# Altium schematic sheet RibbonCable.SchDoc: M1 Test Fixture Custom Board
size OrCAD B; Author: Leo Buchman; Revision: B; SheetNumber: 2; SheetTotal: 4
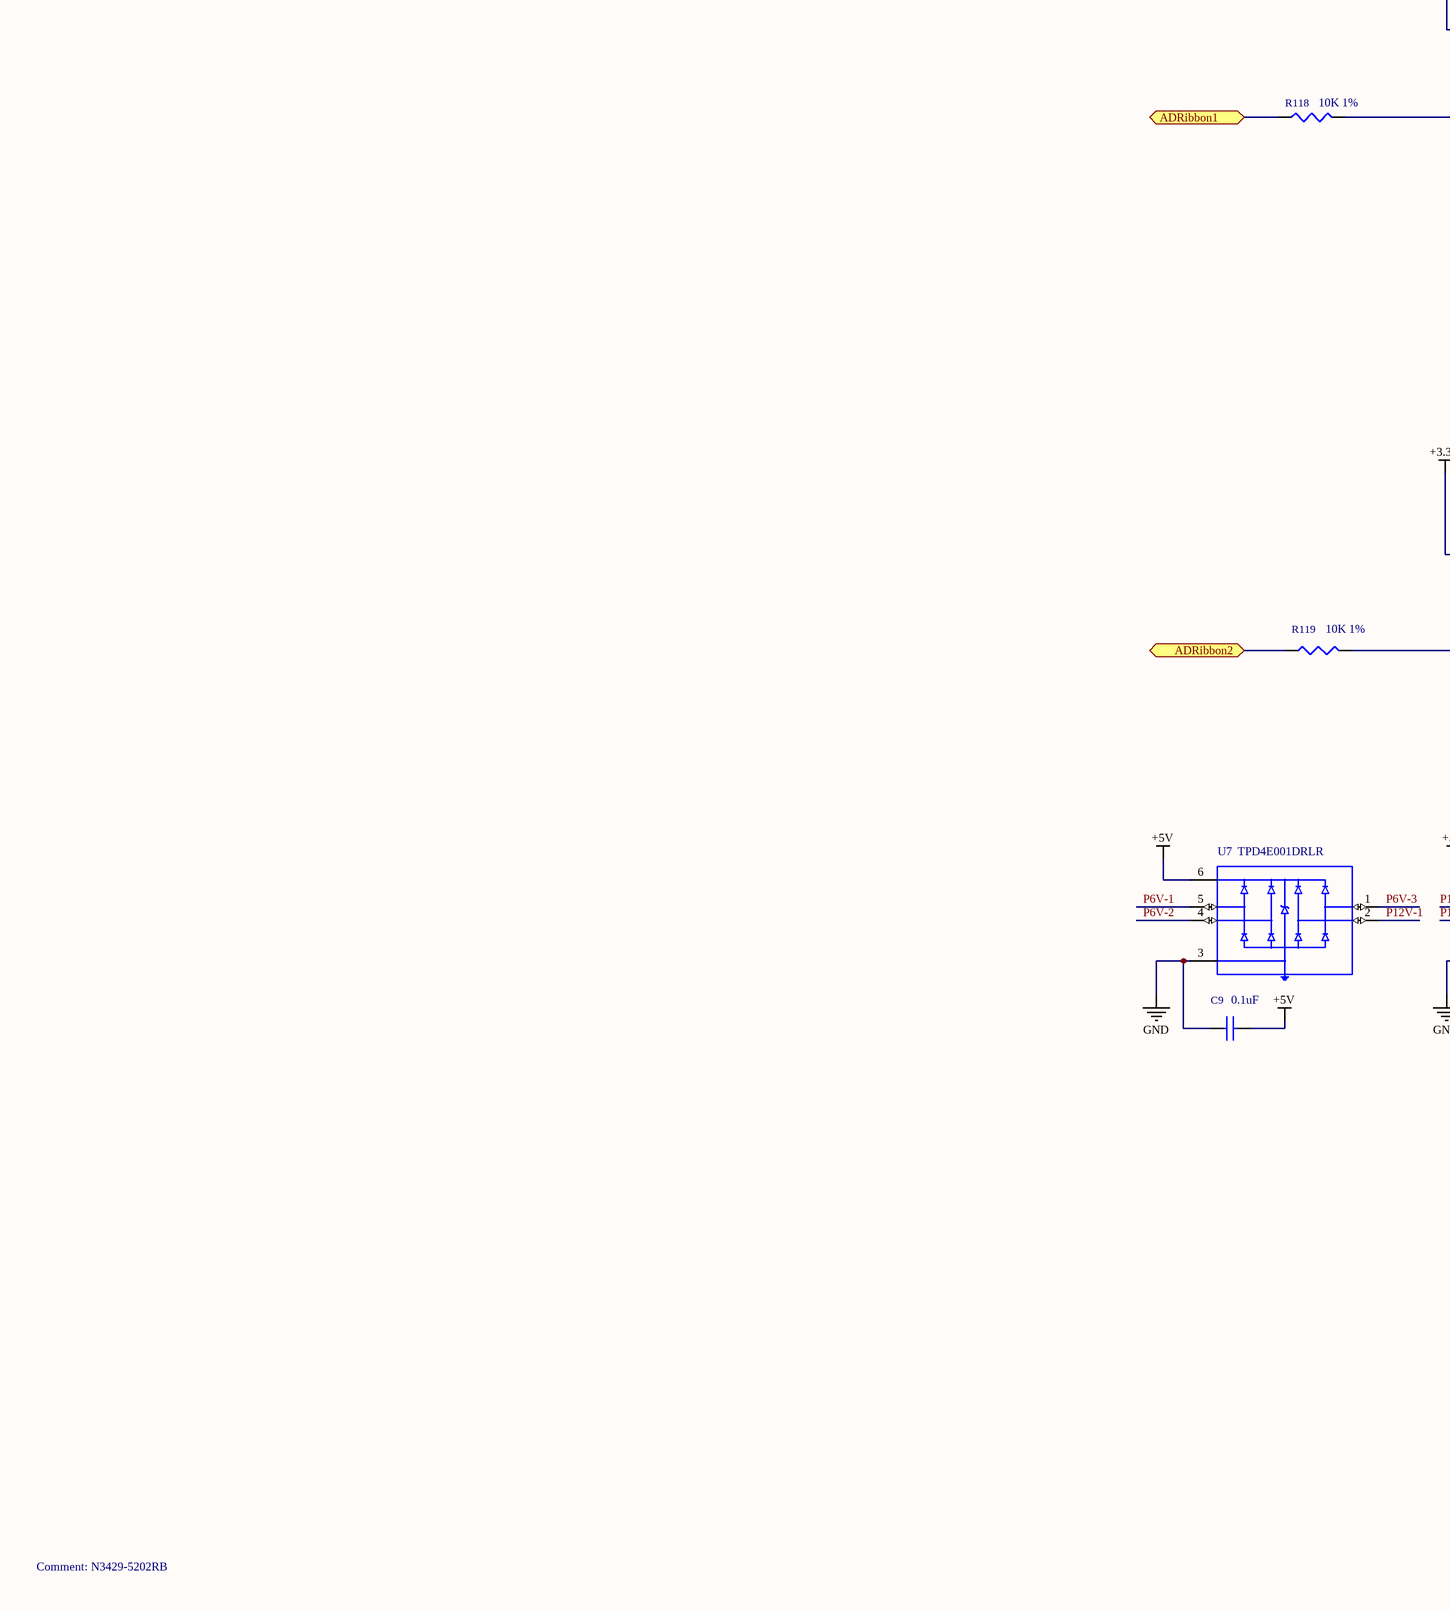
[diagram p0: RibbonCable.SchDoc, left]
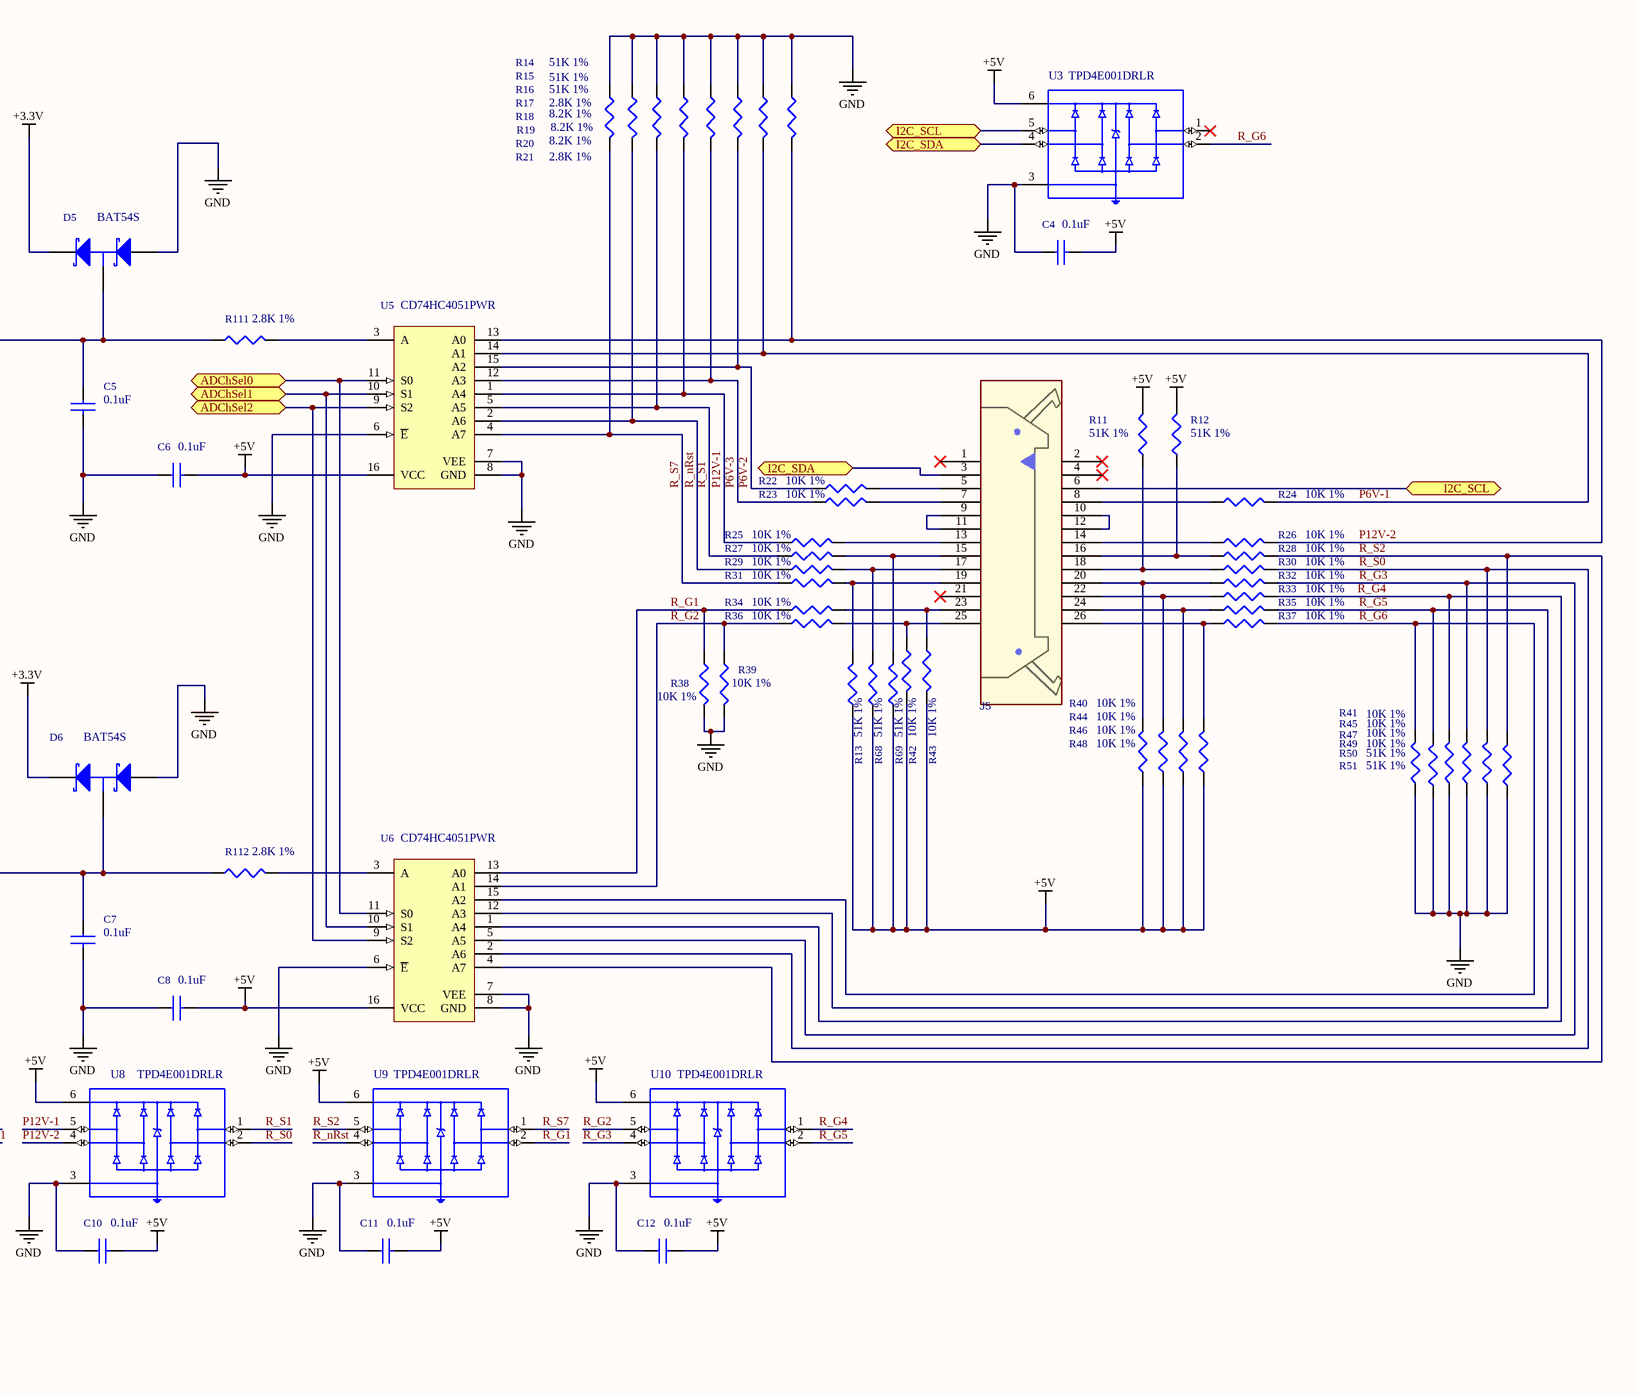
[diagram p1: RibbonCable.SchDoc, right]

## Parts
C4  0.1uF  [C0402]
C5  0.1uF  [C0402]
C6  0.1uF  [C0402]
C7  0.1uF  [C0402]
C8  0.1uF  [C0402]
C9  0.1uF  [C0402]
C10  0.1uF  [C0402]
C11  0.1uF  [C0402]
C12  0.1uF  [C0402]
D5  BAT54S  [sot23-3]
D6  BAT54S  [sot23-3]
J5  N3429-5202RB  [CONN_N3429-5202RB]
R11  51K 1%  [R0402]
R12  51K 1%  [R0402]
R13  51K 1%  [R0402]
R14  51K 1%  [R0402]
R15  51K 1%  [R0402]
R16  51K 1%  [R0402]
R17  2.8K 1%  [R0402]
R18  8.2K 1%  [R0402]
R19  8.2K 1%  [R0402]
R20  8.2K 1%  [R0402]
R21  2.8K 1%  [R0402]
R22  10K 1%  [R0402]
R23  10K 1%  [R0402]
R24  10K 1%  [R0402]
R25  10K 1%  [R0402]
R26  10K 1%  [R0402]
R27  10K 1%  [R0402]
R28  10K 1%  [R0402]
R29  10K 1%  [R0402]
R30  10K 1%  [R0402]
R31  10K 1%  [R0402]
R32  10K 1%  [R0402]
R33  10K 1%  [R0402]
R34  10K 1%  [R0402]
R35  10K 1%  [R0402]
R36  10K 1%  [R0402]
R37  10K 1%  [R0402]
R38  10K 1%  [R0402]
R39  10K 1%  [R0402]
R40  10K 1%  [R0402]
R41  10K 1%  [R0402]
R42  10K 1%  [R0402]
R43  10K 1%  [R0402]
R44  10K 1%  [R0402]
R45  10K 1%  [R0402]
R46  10K 1%  [R0402]
R47  10K 1%  [R0402]
R48  10K 1%  [R0402]
R49  10K 1%  [R0402]
R50  51K 1%  [R0402]
R51  51K 1%  [R0402]
R68  51K 1%  [R0402]
R69  51K 1%  [R0402]
R111  2.8K 1%  [R0402]
R112  2.8K 1%  [R0402]
R118  10K 1%  [R0402]
R119  10K 1%  [R0402]
U3  TPD4E001DRLR  [SOTFL50P160X60-6N]
U5  CD74HC4051PWR  [16-TSSOP-4.4mm]
U6  CD74HC4051PWR  [16-TSSOP-4.4mm]
U7  TPD4E001DRLR  [SOTFL50P160X60-6N]
U8  TPD4E001DRLR  [SOTFL50P160X60-6N]
U9  TPD4E001DRLR  [SOTFL50P160X60-6N]
U10  TPD4E001DRLR  [SOTFL50P160X60-6N]

## Ports
ADChSel0 (bidir), ADChSel1 (bidir), ADChSel2 (bidir), ADRibbon1 (bidir), ADRibbon2 (bidir), I2C_SCL (bidir), I2C_SDA (bidir)

## Nets
+3.3V: D5.2(K) D6.2(K)
+5V: C4.2 C6.2 C8.2 C9.2 C10.2 C11.2 C12.2 R11.2 R12.2 R13.1 R40.1 R42.2 R43.2 R44.1 R46.1 R48.1 R68.1 R69.1 U3.6(VCC) U5.16(VCC) U6.16(VCC) U7.6(VCC) U8.6(VCC) U9.6(VCC) U10.6(VCC)
GND: C4.1 C5.2 C6.1 C7.2 C8.1 C9.1 C10.1 C11.1 C12.1 D5.1(A) D6.1(A) R14.1 R15.1 R16.1 R17.1 R18.1 R19.1 R20.1 R21.1 R38.2 R39.2 R41.1 R45.1 R47.1 R49.1 R50.1 R51.1 U3.3(GND) U5.6(~{E}) U5.7(VEE) U5.8(GND) U6.6(~{E}) U6.7(VEE) U6.8(GND) U7.3(GND) U8.3(GND) U9.3(GND) U10.3(GND)
ADChSel0: U5.11(S0) U6.11(S0) ; port ADChSel0
ADChSel1: U5.10(S1) U6.10(S1) ; port ADChSel1
ADChSel2: U5.9(S2) U6.9(S2) ; port ADChSel2
ADRibbon1: R118.1 ; port ADRibbon1
ADRibbon2: R119.1 ; port ADRibbon2
I2C_SCL: J5.6 U3.5(IO4) ; port I2C_SCL
I2C_SDA: J5.3 U3.4(IO3) ; port I2C_SDA
P6V-1: R20.2 R24.2 U5.14(A1) U7.5(IO4)
P6V-2: R19.2 R22.1 U5.15(A2) U7.4(IO3)
P6V-3: R18.2 R23.1 U5.12(A3) U7.1(IO1)
P12V-1: R17.2 R25.1 U5.1(A4) U7.2(IO2) U8.5(IO4)
P12V-2: R21.2 R26.2 U5.13(A0) U8.4(IO3)
R_G1: R34.1 R38.1 U6.13(A0) U9.2(IO2)
R_G2: R36.1 R39.1 U6.14(A1) U10.5(IO4)
R_G3: R32.2 R49.2 U6.5(A5) U10.4(IO3)
R_G4: R33.2 R47.2 U6.1(A4) U10.1(IO1)
R_G5: R35.2 R45.2 U6.12(A3) U10.2(IO2)
R_G6: R37.2 R41.2 U3.2(IO2) U6.15(A2)
R_nRst: R15.2 R29.1 U5.2(A6) U9.4(IO3)
R_S0: R30.2 R50.2 U6.2(A6) U8.2(IO2)
R_S1: R16.2 R27.1 U5.5(A5) U8.1(IO1)
R_S2: R28.2 R51.2 U6.4(A7) U9.5(IO4)
R_S7: R14.2 R31.1 U5.4(A7) U9.1(IO1)
NetC5_1: C5.1 D5.3(C) R111.1 R118.2
NetC7_1: C7.1 D6.3(C) R112.1 R119.2
NetJ5_5: J5.5 R22.2
NetJ5_7: J5.7 R23.2
NetJ5_8: J5.8 R24.1
NetJ5_9: J5.9 J5.11
NetJ5_10: J5.10 J5.12
NetJ5_13: J5.13 R25.2
NetJ5_14: J5.14 R26.1
NetJ5_15: J5.15 R27.2 R69.2
NetJ5_16: J5.16 R12.1 R28.1
NetJ5_17: J5.17 R29.2 R68.2
NetJ5_18: J5.18 R11.1 R30.1
NetJ5_19: J5.19 R13.2 R31.2
NetJ5_20: J5.20 R32.1 R40.2
NetJ5_22: J5.22 R33.1 R44.2
NetJ5_23: J5.23 R34.2 R43.1
NetJ5_24: J5.24 R35.1 R46.2
NetJ5_25: J5.25 R36.2 R42.1
NetJ5_26: J5.26 R37.1 R48.2
NetR111_2: R111.2 U5.3(A)
NetR112_2: R112.2 U6.3(A)

Not connected (* = marked no-connect by the designer): J5 1* 2* 4* 21*; U3 1(IO1)*

## Library data of the parts
C4-C12 = Cap-00005: Cap Ceramic 0.1uF 50V X7R 10% Pad SMD 0402 125C Automotive T/R; Manufacturer: Murata; Manufacturer Part Number: GRT155R71H104KE01D; Part Name: Cap-00005; Supplier 1: Digi-Key; Supplier Part Number 1: 490-GRT155R71H104KE01DCT-ND; RoHS: Yes; Category: Ceramic Capacitors; Stock 1: 179948; Pricing 1: 1=0.10000, 10=0.04700, 50=0.02580, 100=0.0211; Mount: Surface Mount; Case/Package: 0402; Case Code (Metric): 1005; Case Code (Imperial): 0402; RoHS Compliant: Yes; LCSC Part Number: C307331; Number of Pins: 2; Dielectric Material: Ceramic; Termination: SMD/SMT; Voltage Rating (DC): 50V
D5 D6 = Diode-0009: DIODE SCHOTTKY 30V 150MA SOT23-3; Manufacturer: Sangdest Microelectronics; Manufacturer: ON Semiconductor / Fairchild; Recovery Time: 5ns; Package Version: Rev. 12, 03/2016; Peak Reverse Current: 2uA; Elements: 2; Package Reference: SOT23-3; Package URL: http://www.fairchildsemi.com/dwg/MA/MA03D.pdf; Pins: 3; Datasheet URL: https://www.fairchildsemi.com/datasheets/BA/BAT54S.pdf; Manufacturer URL: https://www.fairchildsemi.com/; Datasheet Version: Rev. 2.3, 04/2016; Mounting Technology: SM; Package Description: 3-Pin Small Outline Transistor, Body 2.92 x 1.325 mm, Pitch 0.95 mm; Manufacturer Part Number: BAT54S; Component Type: Diodes; Part Name: Diode-0009; Supplier 1: Digi-Key; Supplier Part Number 1: 1655-BAT54SCT-ND; RoHS: Yes; Stock 1: 168252; Pricing 1: 1=0.43000, 10=0.35100, 100=0.18620, 500=0.122; Mount: Surface Mount; Radiation Hardening: No; Lead Free: Lead Free; LCSC Part Number: C47546
J5 = CON-0010: 3000 Series; 2.54mm Pitch 26 Way 2 Row Right; Manufacturer: 3M; ATTR: CONN HEADER LATCH/EJEC  RTA DUAL ROW 26POS; PKG: 2M54_13x2_TH_LATCH; Connector Type: Male Pin; Number of Positions: 26; Current Rating: 1A; Voltage Rating: 300V; Gender: Male; Number of Positions Per Level: 8; Number of Levels: 1; Max Current Rating: 2A; Current: 12A; Shrouded: Yes (With); Tail Length: 3.5mm; Wire Gauge (Max): 30AWG; Row Spacing: 0.1inch; Closed End: No (Without); Plating: Brass; Thread Size: M2; Part Name: CON-0010; Supplier 1: Digi-Key; Supplier Part Number 1: MHR26S-ND; Manufacturer Part Number: N3429-5202RB; RoHS: Yes; Stock 1: 185; Pricing 1: 1=5.34000, 10=4.85100, 100=4.27430, 500=3.633; LCSC Part Number: N/A; Category: Headers and Wire Housings; Mount: Through Hole; Color: Black; Contact Material: Copper Alloy,Copper; Contact Plating: Gold; Housing Material: Polychlorinated; Min Operating Temperature: -55°C; Max Operating Temperature: 105°C; Packaging: Bulk; Number of Rows: 2; Termination: Solder; ComponentLink1URL: https://datasheet.ciiva.com/19461/1578947-194; ComponentLink1Description: https://datasheet.ciiva.com/19461/1578947-194; Package Quantity: 250; Series: 3000; Contact Type: Male Pin; Pitch: 2.54mm; Contact Mating Length: 0.24inch; RoHS Compliant: Yes; Number of Contacts: 26; REACH SVHC: No SVHC; Lead Free: Lead Free; ComponentLink2URL: https://datasheet.ciiva.com/11754/0900766b807; ComponentLink2Description: https://datasheet.ciiva.com/11754/0900766b807; ComponentLink3URL: https://datasheet.ciiva.com/719/ts0772-719341; ComponentLink3Description: https://datasheet.ciiva.com/719/ts0772-719341; ComponentLink4URL: https://datasheet.ciiva.com/8051/ts0772-80510; ComponentLink4Description: https://datasheet.ciiva.com/8051/ts0772-80510; Flammability Rating: UL94 V-0; Orientation: Right Angle; Length: 52.45mm; Depth: 24.6mm; Voltage: 300V; ComponentLink5URL: https://datasheet.ciiva.com/30156/eng-cs-1308; ComponentLink5Description: https://datasheet.ciiva.com/30156/eng-cs-1308; ComponentLink6URL: https://datasheet.ciiva.com/3141/eng-cs-13083; ComponentLink6Description: https://datasheet.ciiva.com/3141/eng-cs-13083; Housing Color: Black; Fastening Type: Latch; Max Voltage Rating (AC): 300V; Height: 8.6mm; Radiation Hardening: No; ELV: Compliant; ComponentLink7URL: https://datasheet.ciiva.com/823/eng-cd-284391; ComponentLink7Description: https://datasheet.ciiva.com/823/eng-cd-284391; Number of Circuits: 8; Wire Gauge (Min): 30AWG; Interlock: Yes (With); Max Supply Voltage (AC): 300V; Screw Flange: No (Without); Screwless Terminal Block: No (Without); Side Stackable: Yes (With)
R11-R16 R50 R51 R68 R69 = Res-00011: Res Thick Film 0402 51K Ohm 1% 0.063W(1/16W) ±100ppm/C Pad SMD Automotive T/R; Manufacturer: Stackpole Electronics; Manufacturer Part Number: RMCF0402FT51K0; Resistance: 51kR; Max Power Dissipation: 63mW; Temperature Coefficient: 100ppm/°C; Part Name: Res-00011; Supplier 1: Digi-Key; Supplier Part Number 1: RMCF0402FT51K0CT-ND; RoHS: Yes; Category: Chip SMD Resistors; Stock 1: 588931; Pricing 1: 1=0.10000, 10=0.01500, 100=0.00610, 1000=0.00; Case/Package: 0402; Case Code (Metric): 1005; Case Code (Imperial): 0402; Min Operating Temperature: -55°C; Max Operating Temperature: 155°C; Packaging: Tape and Reel; Resistor Type: Thick Film; Number of Terminations: 2; Tolerance: 1%; Features: Automotive AEC-Q200; Length: 0.039inch; Width: 0.02inch; Height: 0.016inch; RoHS Compliant: Yes; ComponentLink1URL: http://components.arrow.com/part/dataview/535; ComponentLink1Description: http://components.arrow.com/part/dataview/535; ComponentLink2URL: https://www.seielect.com/catalog/SEI-RMCF_RMC; ComponentLink2Description: https://www.seielect.com/catalog/SEI-RMCF_RMC; ComponentLink3URL: https://www.seielect.com/Catalog/SEI-RMCF_RMC; ComponentLink3Description: https://www.seielect.com/Catalog/SEI-RMCF_RMC; ComponentLink4URL: https://www.seielect.com/catalog/SEI-Packagin; ComponentLink4Description: https://www.seielect.com/catalog/SEI-Packagin; LCSC Part Number: C25794; Mount: Surface Mount; Contact Plating: Tin,Matte; Power Rating: 63mW; Series: RMCF; Radiation Hardening: No
R17 R21 R111 R112 = Res-00008: Thick Film 0402 2.8K Ohm 1% 0.063W ±100ppm/°C Molded SMD Paper T/R; Manufacturer: Stackpole Electronics; Manufacturer Part Number: RMCF0402FT2K80; Resistance: 2.8kR; Max Power Dissipation: 63mW; Power Rating: 62.5mW; Part Name: Res-00008; Supplier 1: Digi-Key; Supplier Part Number 1: RMCF0402FT2K80CT-ND; RoHS: Yes; Category: Chip SMD Resistors; Stock 1: 141882; Pricing 1: 1=0.10000, 10=0.01500, 100=0.00610, 1000=0.00; Case/Package: 0402; Case Code (Metric): 1005; Case Code (Imperial): 0402; Min Operating Temperature: -55°C; Max Operating Temperature: 155°C; Packaging: Tape and Reel; Resistor Type: Thick Film; Number of Terminations: 2; Tolerance: 1%; Temperature Coefficient: 100ppm/°C; Features: Automotive AEC-Q200; Length: 0.039inch; Width: 0.02inch; Height: 0.016inch; RoHS Compliant: Yes; ComponentLink1URL: https://www.seielect.com/catalog/SEI-RMCF_RMC; ComponentLink1Description: https://www.seielect.com/catalog/SEI-RMCF_RMC; ComponentLink2URL: https://www.seielect.com/Catalog/SEI-RMCF_RMC; ComponentLink2Description: https://www.seielect.com/Catalog/SEI-RMCF_RMC; ComponentLink3URL: https://www.seielect.com/catalog/SEI-Packagin; ComponentLink3Description: https://www.seielect.com/catalog/SEI-Packagin; LCSC Part Number: C62741; Mount: Surface Mount; Contact Plating: Tin,Matte; Series: RMCF; Radiation Hardening: No; Lead Free: Lead Free
R18-R20 = Res-00012: Res Thick Film 0402 8.2K Ohm 5% 0.063W ±100ppm/°C Molded SMD Paper T/R; Manufacturer: Stackpole Electronics; Manufacturer Part Number: RMCF0402JT8K20; Resistance: 8.2kR; Max Power Dissipation: 63mW; Part Name: Res-00012; Supplier 1: Digi-Key; Supplier Part Number 1: 738-RMCF0402JT8K20CT-ND; RoHS: Yes; Category: Chip SMD Resistors; Stock 1: 9938; Pricing 1: 1=0.10000, 10=0.01200, 100=0.00470, 1000=0.00; Case/Package: 0402; Case Code (Metric): 1005; Case Code (Imperial): 0402; Min Operating Temperature: -55°C; Max Operating Temperature: 155°C; Packaging: Tape and Reel; Resistor Type: Thick Film; Number of Terminations: 2; Tolerance: 5%; Temperature Coefficient: 100ppm/°C; Features: Automotive AEC-Q200; Length: 0.039inch; Width: 0.02inch; Height: 0.016inch; RoHS Compliant: Yes; ComponentLink1URL: https://www.seielect.com/Catalog/SEI-RMCF_RMC; ComponentLink1Description: https://www.seielect.com/Catalog/SEI-RMCF_RMC; ComponentLink2URL: https://www.seielect.com/catalog/sei-rmcf_rmc; ComponentLink2Description: https://www.seielect.com/catalog/sei-rmcf_rmc; ComponentLink3URL: https://www.seielect.com/catalog/SEI-RMCF_RMC; ComponentLink3Description: https://www.seielect.com/catalog/SEI-RMCF_RMC; ComponentLink4URL: http://www.seielect.com/Catalog/Sei-RMC.pdf?s; ComponentLink4Description: http://www.seielect.com/Catalog/Sei-RMC.pdf?s; LCSC Part Number: C25924; Mount: Surface Mount; Contact Plating: Tin,Matte; Power Rating: 63mW; Series: RMCF; Radiation Hardening: No; Size Code: 0402; Lead Free: Lead Free
R22-R49 R118 R119 = Res-00002: Thick Film 0402 10K OHM 1% 1/16W 0402; Manufacturer: Yageo; Manufacturer Part Number: RC0402FR-0710KP; Max Power Dissipation: 63mW; Temperature Coefficient: 150ppm/°C; Power Rating: 62.5mW; Part Name: Res-00002; Supplier 1: Digi-Key; Supplier Part Number 1: YAG1249CT-ND; RoHS: Yes; Category: Chip SMD Resistors; Stock 1: 161500; Pricing 1: 1=0.10000, 10=0.03600, 100=0.01450, 1000=0.00; Case/Package: 0402; Case Code (Metric): 1005; Case Code (Imperial): 0402; Min Operating Temperature: -55°C; Max Operating Temperature: 155°C; Packaging: Tape and Reel; Resistance: 10k; Resistor Type: Thick Film; Number of Terminations: 2; Tolerance: 1%; Features: Moisture Resistant; Length: 0.039inch; Width: 0.02inch; Height: 0.016inch; RoHS Compliant: Yes; ComponentLink1URL: http://www.yageo.com/NewPortal/yageodocoutput; ComponentLink1Description: http://www.yageo.com/NewPortal/yageodocoutput; LCSC Part Number: C25744; Mount: Surface Mount
U3 U7-U10 = Diode-0012: TVS DIODE 5.5VWM SOT6; Manufacturer: Texas Instruments; Capacitance: 1.5pF; Max Power Dissipation: 100W; Breakdown Voltage: 11V; Direction: Unidirectional; Reverse Standoff Voltage: 5.5V; Clamping Voltage: 105.5V; Power Line Protection: Yes; Number of Channels: 4; Leakage Current: 1nA; Peak Pulse Current: 5.5A; Interface: LVDS,USB,Ethernet; Part Name: Diode-0012; Supplier 1: Digi-Key; Supplier Part Number 1: 296-21887-1-ND; Manufacturer Part Number: TPD4E001DRLR; RoHS: Yes; Category: ESD and Circuit Protection ICs; Stock 1: 42388; Pricing 1: 1=0.66000, 10=0.58100, 100=0.44520, 500=0.351; Mount: Surface Mount; Case/Package: SOT; Packaging: Tape and Reel; RoHS Compliant: Yes; ComponentLink1URL: https://datasheet.ciiva.com/5839/1535398-5839; ComponentLink1Description: https://datasheet.ciiva.com/5839/1535398-5839; ComponentLink2URL: https://datasheet.ciiva.com/22696/1831342-226; ComponentLink2Description: https://datasheet.ciiva.com/22696/1831342-226; ComponentLink3URL: https://datasheet.ciiva.com/1219/tpd4e001-121; ComponentLink3Description: https://datasheet.ciiva.com/1219/tpd4e001-121; Number of Pins: 6; Min Operating Temperature: -40°C; Max Operating Temperature: 85°C; Package Quantity: 1; Series: -; Radiation Hardening: No; Lead Free: Lead Free; ComponentLink4URL: https://datasheet.ciiva.com/15134/getdatashee; ComponentLink4Description: https://datasheet.ciiva.com/15134/getdatashee; ComponentLink5URL: https://datasheet.ciiva.com/7659/1853592-7659; ComponentLink5Description: https://datasheet.ciiva.com/7659/1853592-7659; ComponentLink6URL: https://datasheet.ciiva.com/338/tpd4e001-3380; ComponentLink6Description: https://datasheet.ciiva.com/338/tpd4e001-3380; ComponentLink7URL: https://datasheet.ciiva.com/338/tpd4e001-3380; ComponentLink7Description: https://datasheet.ciiva.com/338/tpd4e001-3380; ComponentLink8URL: https://datasheet.ciiva.com/338/tpd4e001-3380; ComponentLink8Description: https://datasheet.ciiva.com/338/tpd4e001-3380; LCSC Part Number: C527516; Length: 1.6mm; Depth: 1.2mm; Width: 1.2mm; Height: 0.55mm; Contact Plating: Gold; Weight: 9.9E-05oz; Termination: SMD/SMT; REACH SVHC: No SVHC; Min Breakdown Voltage: 11V; Peak Pulse Power: 100W; Polarity: Unidirectional; Working Voltage: 5.5V; Max Breakdown Voltage: 11V; Operating Supply Voltage: 5.5V; Number of Bidirectional Channels: 4; ComponentLink9URL: https://datasheet.ciiva.com/14423/tpd4e001-14; ComponentLink9Description: https://datasheet.ciiva.com/14423/tpd4e001-14
U5 U6 = AIC-0001: 5-V, 8: 1, 1-channel analog mutliplexer 16-TS; Manufacturer: Texas Instruments; VCC(Max)(V): 6; Ron(Typ)(Ohms): 45; Rating: Catalog; VCC(Min)(V): 2; Ron(Max)(Ohms): 130; Configuration: 1 X 1：8 MUX; Crosstalk: Yes; Bandwidth(Max)(MHz): 180; Bandwidth: 180MHz; Propagation Delay: 60ns; Number of Outputs: 1; Max Supply Voltage: 6V; Min Supply Voltage: 2V; Number of Inputs: 8; Min Dual Supply Voltage: 1V; Max Dual Supply Voltage: 5V; Dual Supply Voltage: 3V; Logic Function: Multiplexer,Demultiplexer; On-State Resistance: 130R; Turn-On Delay Time: 225ns; Supply Type: Single,Dual; Nominal Supply Current: 16uA; Polarity: Non-Inverting; Low Level Output Current: 25mA; PackageVersion: http://www.ti.com/lit/ml/mpds178g/mpds178g.pdf; Generic Part Number: CD74HC4051; PackageReference: D0016A; Operating Temperature Range(C): -55 to 125; DatasheetVersion: SCHS122J; Code_JEDEC: MS-012 variation AC; Manufacturer Part Number: CD74HC4051PWR; Part Name: AIC-0001; LCSC Part Number: C352826; Supplier 1: Newark; Supplier Part Number 1: 29AH3620; RoHS: Yes; Category: Decoders and Multiplexers; Stock 1: 12645; Pricing 1: 1=0.33420, 10=0.26780, 30=0.23940, 100=0.2039; Mount: Surface Mount; Case/Package: TSSOP; Number of Pins: 16; Weight: 0.002183oz; Contact Plating: Gold; Min Operating Temperature: -55°C; Max Operating Temperature: 125°C; Package Quantity: 1; Packaging: Tape and Reel; Number of Channels: 1; Turn-Off Delay Time: 225ns; Number of Bits: 8; Series: 74HC; Number of Circuits: 1; High Level Output Current: 25mA; Number of Switches: 1; Max Output Current: 25mA; Termination: SMD/SMT; Supply Current: 16uA; Length: 5mm; Width: 4.4mm; Height: 1.15mm; Radiation Hardening: No; Lead Free: Lead Free; RoHS Compliant: Yes; REACH SVHC: No SVHC; ComponentLink1URL: https://datasheet.ciiva.com/15127/getdatashee; ComponentLink1Description: https://datasheet.ciiva.com/15127/getdatashee; ComponentLink2URL: https://datasheet.ciiva.com/27092/1326571-270; ComponentLink2Description: https://datasheet.ciiva.com/27092/1326571-270; ComponentLink3URL: https://datasheet.ciiva.com/1514/1789854-1514; ComponentLink3Description: https://datasheet.ciiva.com/1514/1789854-1514; ComponentLink4URL: https://datasheet.ciiva.com/1171/1633734-1171; ComponentLink4Description: https://datasheet.ciiva.com/1171/1633734-1171; ComponentLink5URL: https://datasheet.ciiva.com/1171/1633734-1171; ComponentLink5Description: https://datasheet.ciiva.com/1171/1633734-1171; ComponentLink6URL: https://datasheet.ciiva.com/2978/cd74hct4053-; ComponentLink6Description: https://datasheet.ciiva.com/2978/cd74hct4053-; ComponentLink7URL: https://datasheet.ciiva.com/46391/1840262-463; ComponentLink7Description: https://datasheet.ciiva.com/46391/1840262-463